# EAGLE design pierwszy_schemat_dobrow (EAGLE 9.6.2)
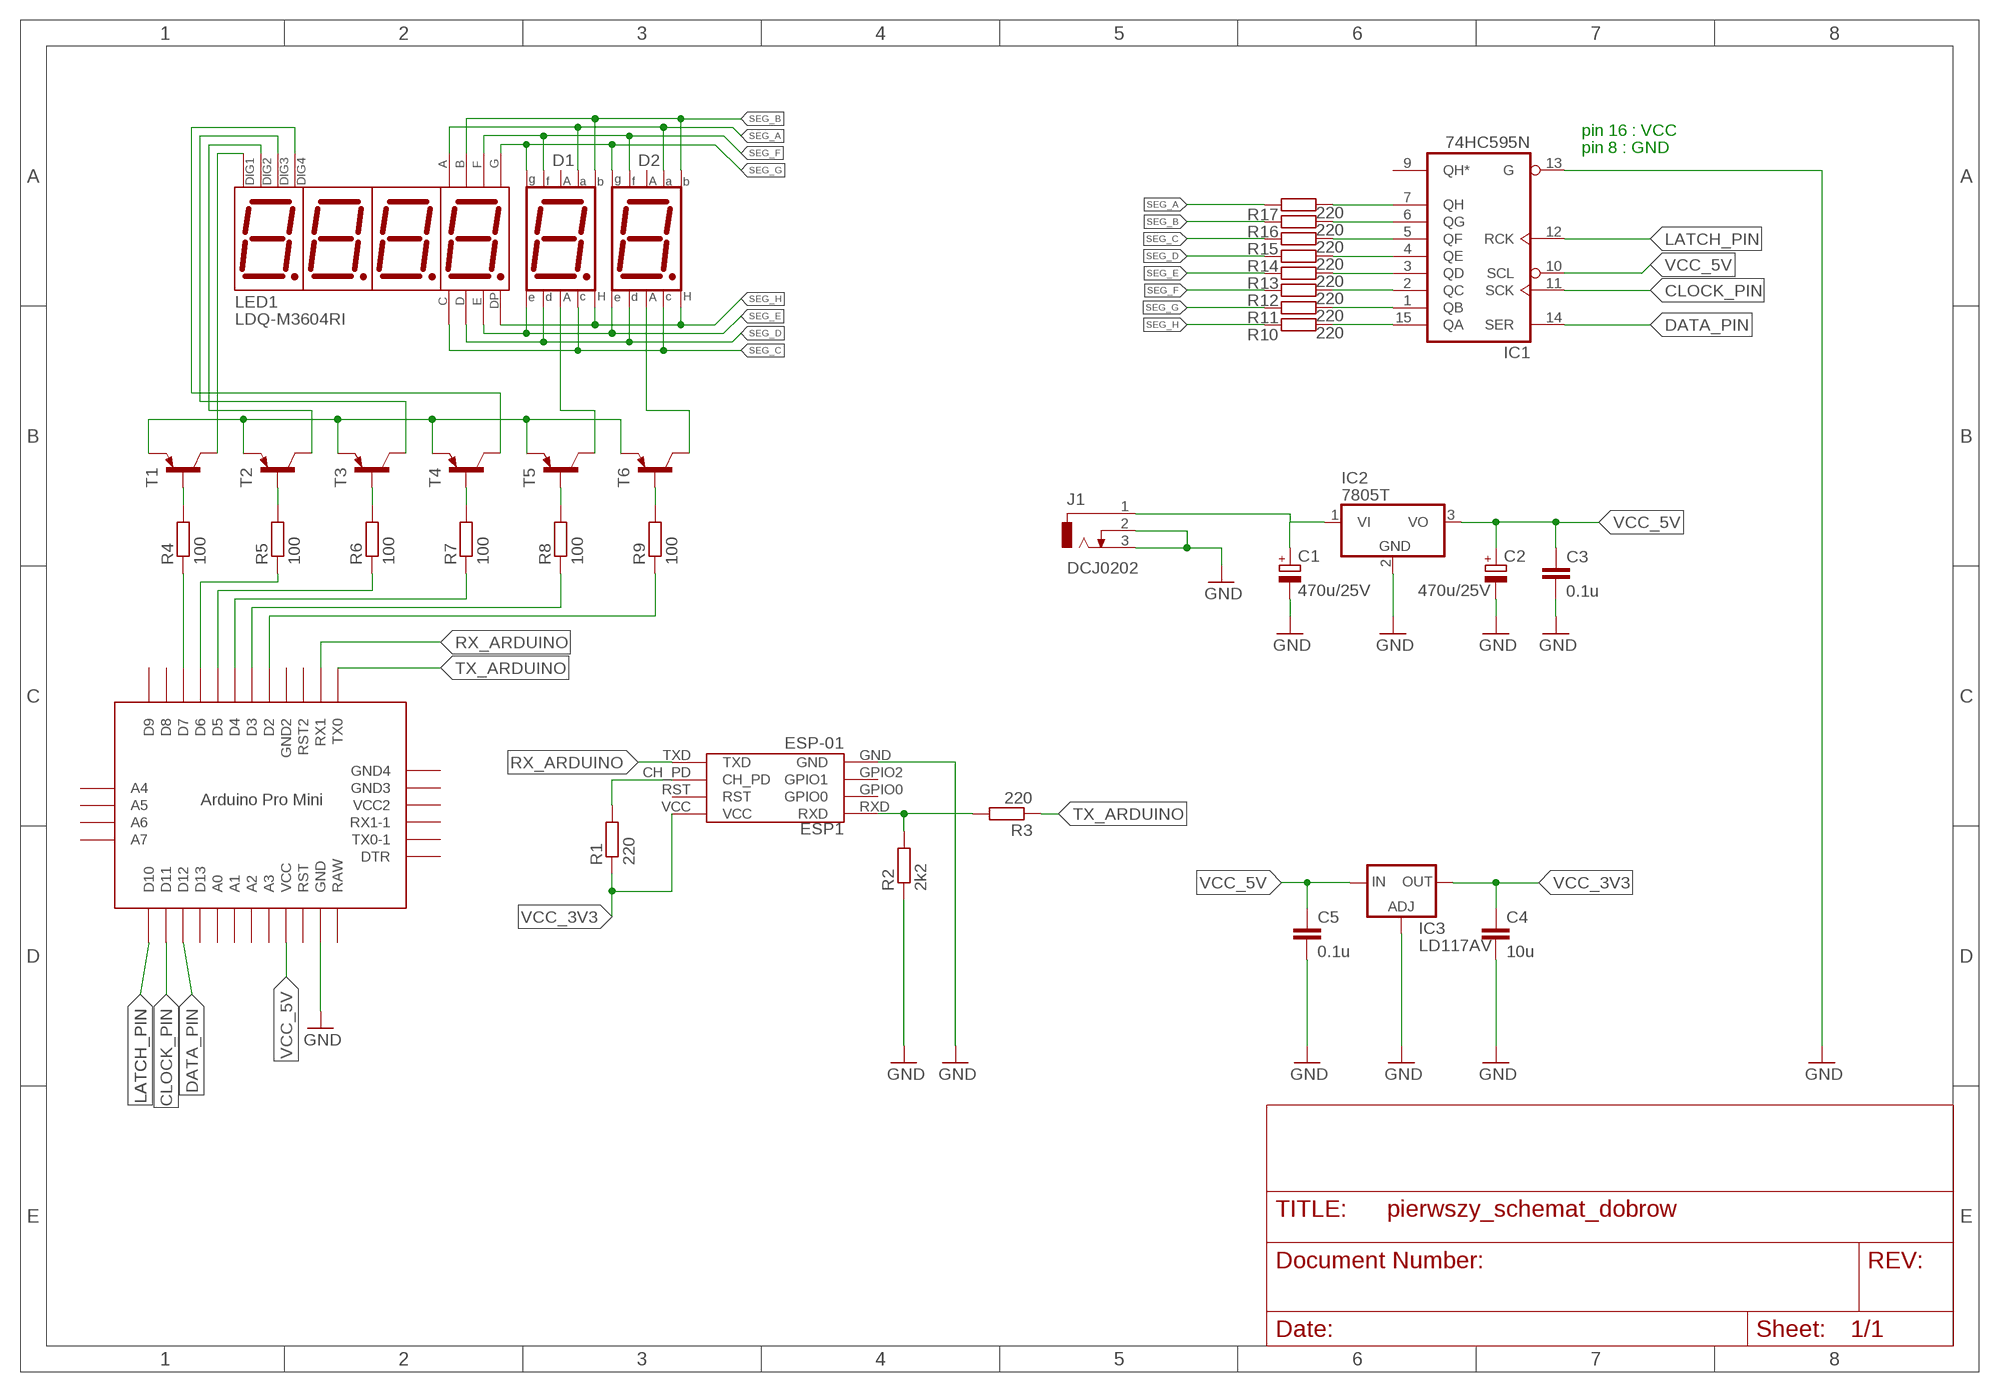
[diagram p0: schematic, sheet 1]

## Parts
C1  470u/25V  CPOL-EUE5-8.5  [E5-8,5]
C2  470u/25V  CPOL-EUE5-8.5  [E5-8,5]
C3  0.1u  C-EU025-025X050  [C025-025X050]
C4  10u  C-EU025-025X050  [C025-025X050]
C5  0.1u  C-EU025-025X050  [C025-025X050]
D1  7SEG-CA  [7SEG-13]
D2  7SEG-CA  [7SEG-13]
ESP1  ESP-01  [ESP-01]
IC1  74HC595N  [DIL16]
IC2  7805T  [TO220H]
IC3  LD117AV  [TO220L1]
J1  DCJ0202  [DCJ0202]
LED1  LDQ-M3604RI  [LDQ-M3604RI]
R1  220  R-EU_0414/15  [0414/15]
R2  2k2  R-EU_0414/15  [0414/15]
R3  220  R-EU_0414/15  [0414/15]
R4  100  R-EU_0414/15  [0414/15]
R5  100  R-EU_0414/15  [0414/15]
R6  100  R-EU_0414/15  [0414/15]
R7  100  R-EU_0414/15  [0414/15]
R8  100  R-EU_0414/15  [0414/15]
R9  100  R-EU_0414/15  [0414/15]
R10  220  R-EU_0414/15  [0414/15]
R11  220  R-EU_0414/15  [0414/15]
R12  220  R-EU_0414/15  [0414/15]
R13  220  R-EU_0414/15  [0414/15]
R14  220  R-EU_0414/15  [0414/15]
R15  220  R-EU_0414/15  [0414/15]
R16  220  R-EU_0414/15  [0414/15]
R17  220  R-EU_0414/15  [0414/15]
T1  BC556A-PNP-TO92-EBC  [TO92-EBC]
T2  BC556A-PNP-TO92-EBC  [TO92-EBC]
T3  BC556A-PNP-TO92-EBC  [TO92-EBC]
T4  BC556A-PNP-TO92-EBC  [TO92-EBC]
T5  BC556A-PNP-TO92-EBC  [TO92-EBC]
T6  BC556A-PNP-TO92-EBC  [TO92-EBC]
U$1  PRO-MINI  [PRO-MINI]

## Nets
CLOCK_PIN: IC1.11(SCK) U$1.D11
DATA_PIN: IC1.14(SER) U$1.D12
GND: C1.- C2.- C3.2 C4.2 C5.2 ESP1.GND IC1.13(G) IC2.2(GND) IC3.1(ADJ) J1.2 J1.3 R2.1 U$1.GND
LATCH_PIN: IC1.12(RCK) U$1.D10
N$1: R4.2 T1.B
N$2: R5.2 T2.B
N$3: R6.2 T3.B
N$4: R7.2 T4.B
N$5: R8.2 T5.B
N$6: R9.2 T6.B
N$7: T1.E T2.E T3.E T4.E T5.E T6.E
N$8: LED1.9(DIG2) T2.C
N$10: ESP1.CH_PD R1.2
N$12: IC1.15(QA) R10.2
N$13: IC1.1(QB) R11.2
N$14: IC1.2(QC) R12.2
N$15: IC1.3(QD) R13.2
N$16: IC1.4(QE) R14.2
N$17: IC1.5(QF) R15.2
N$18: IC1.6(QG) R16.2
N$19: IC1.7(QH) R17.2
N$26: LED1.12(DIG1) T1.C
N$27: LED1.8(DIG3) T3.C
N$28: LED1.6(DIG4) T4.C
N$29: D1.8(CA2) T5.C
N$30: D2.8(CA2) T6.C
N$31: R4.1 U$1.D7
N$32: R5.1 U$1.D6
N$33: R6.1 U$1.D5
N$34: R7.1 U$1.D4
N$35: R8.1 U$1.D3
N$36: R9.1 U$1.D2
RX_ARDUINO: ESP1.TXD U$1.RX1
SEG_A: D1.7(A) D2.7(A) LED1.11(A) R17.1
SEG_B: D1.6(B) D2.6(B) LED1.7(B) R16.1
SEG_C: D1.4(C) D2.4(C) LED1.4(C) R15.1
SEG_D: D1.2(D) D2.2(D) LED1.2(D) R14.1
SEG_E: D1.1(E) D2.1(E) LED1.1(E) R13.1
SEG_F: D1.9(F) D2.9(F) LED1.10(F) R12.1
SEG_G: D1.10(G) D2.10(G) LED1.5(G) R11.1
SEG_H: D1.5(DP) D2.5(DP) LED1.3(DP) R10.1
TX_ARDUINO: ESP1.RXD R2.2 R3.1 R3.2 U$1.TX0
VCC_3V3: C4.1 ESP1.VCC IC3.2(OUT) R1.1
VCC_5V: C2.+ C3.1 C5.1 IC1.10(SCL) IC2.3(VO) IC3.3(IN) U$1.VCC
VIN_9V: C1.+ IC2.1(VI) J1.1
Unconnected: D1.3(CA1) D2.3(CA1) ESP1.GPIO0 ESP1.GPIO2(GPIO1) ESP1.RST IC1.9(QH*) U$1.A0 U$1.A1 U$1.A2 U$1.A3 U$1.A4 U$1.A5 U$1.A6 U$1.A7 U$1.D8 U$1.D9 U$1.D13 U$1.DTR U$1.GND1(GND2) U$1.GND2(GND4) U$1.GND3 U$1.RST U$1.RST1(RST2) U$1.RX1-1 U$1.TX0-1 U$1.VCC1(VCC2)

## Notes on the sheet
- pin 16 : VCC
- pin 8 : GND

## Power pins joined to a net without a drawn wire
GND: IC1.8(GND)
RAW: U$1.RAW
VCC: IC1.16(VCC)

## Library data of the parts
C1 C2 = rcl:CPOL-EU: POLARIZED CAPACITOR, European symbol; SPICEPREFIX: C
C3-C5 = rcl:C-EU: CAPACITOR, European symbol; SPICEPREFIX: C
D1 D2 = 7SEG-vertical:7SEG-CA: 7-segment DISPLAY single anode, 13 mm
ESP1 = ESP-01:ESP-01: Check prices <https://pricing.snapeda.com/parts/ESP-01/AI-Thinker/view-part?ref=eda>; AVAILABILITY: Not in stock; DESCRIPTION: ESP-01M ESP8266 DIP Adapter series Transceiver; 802.11 b/g/n (Wi-Fi, WiFi, WLAN) Evaluation Board; MF: AI-Thinker; MP: ESP-01; PACKAGE: Non-Standard AI-Thinker; PRICE: None
IC1 = 74xx-eu:74*595: 8-bit SHIFT REGISTER, output latch
IC2 = adafruit:78*: Positive VOLTAGE REGULATOR Added bigger pads to the TO-92 package
IC3 = v-reg:LD117A?*: Low drop fixed and adjustable positive voltage regulators 1 A Source: http://www.st.com/stonline/products/literature/ds/7194/ld1117axx.pdf
J1 = con-jack:DCJ0202: DC POWER JACK Source: DCJ0202.pdf; OC_FARNELL: unknown; OC_NEWARK: unknown
LED1 = LDQ-M3604RI:LDQ-M3604RI: Check prices <https://pricing.snapeda.com/parts/LDQ-M3604RI/Lumex/view-part?ref=eda>; AVAILABILITY: In Stock; DESCRIPTION: Display, Seven Segment, 9.2MM, Red; MF: Lumex; MP: LDQ-M3604RI; PACKAGE: None; PRICE: None
R1-R17 = rcl:R-EU_: RESISTOR, European symbol; SPICEPREFIX: R
T1-T6 = transistor:*-PNP-: PNP Transistror
U$1 = Arduino-clone:PRO-MINI: Arduion Pro Mini Clone V1.0 www.betemcu.cu

## Board
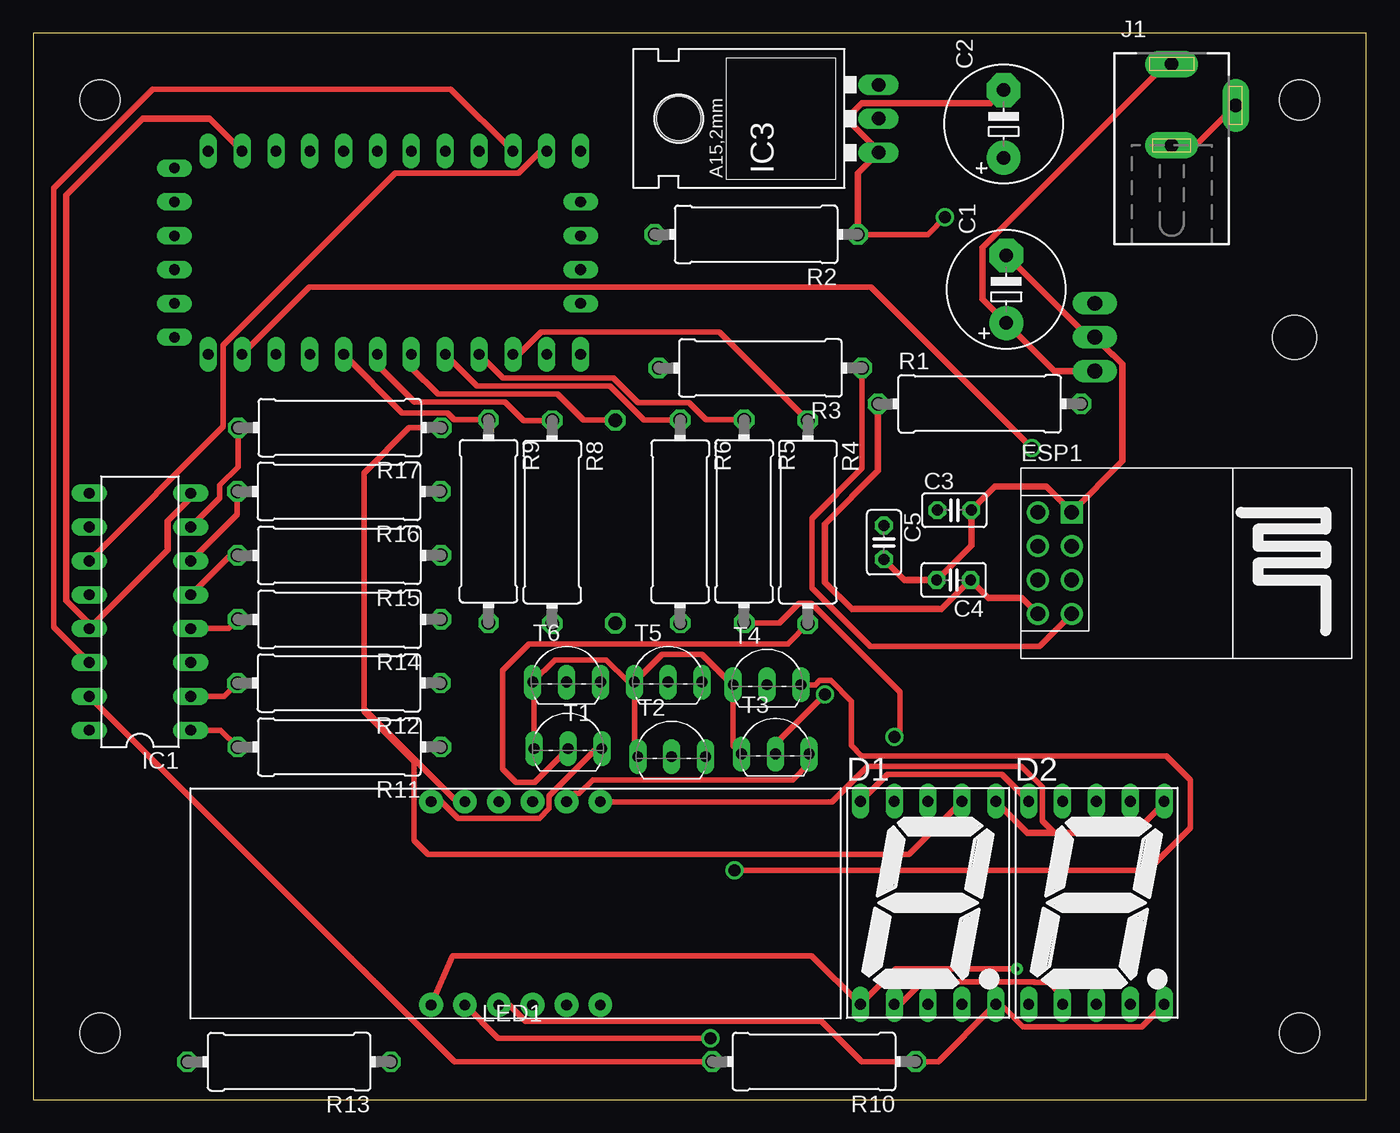
[diagram p1: board, top side]
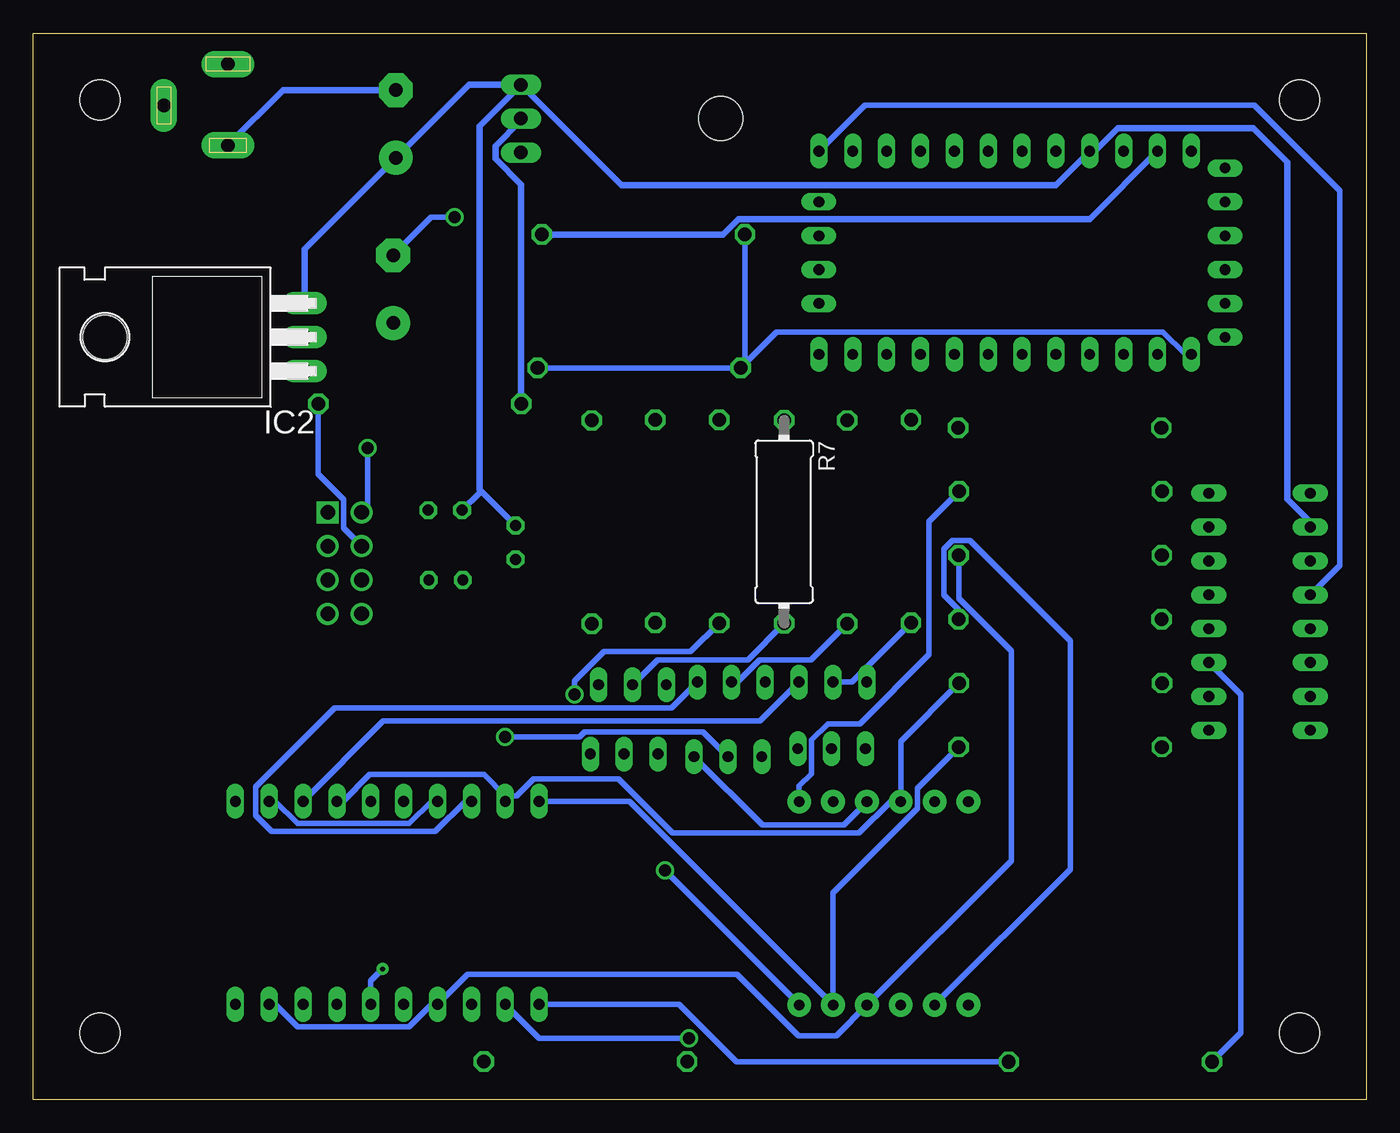
[diagram p2: board, bottom side, seen from below]

Size 100 x 80 mm. Coordinates in mm from the lower left corner, seen from the top.
Outline: 0,0 100,0 100,80 0,80 0,0
Copper layers (1*16): Top 0.035mm / dielectric 1.5mm / Bottom 0.035mm
Design rules "default *": minimum track width 6mil, minimum drill 0.35mm, track to track 8mil, track to pad 6mil, pad to pad 6mil, via to via 6mil, smd to smd 6mil, copper to edge 20mil, drill to drill 6mil, minimum pad ring 10mil, minimum via ring 8mil, stop-mask expansion 4mil, vias tented up to drill 0mil, thermal gap 10mil
Holes 3 mm at 5,5 95,5 95,75 5,75

### Footprints (pad centres in the part's own frame; a part is rotated, then mirrored left to right if it is on the bottom)
E5-8,5 = drill 1.016 pad 2.54: + -2.54,0 | drill 1.016 pad 2.54 octagon: - 2.54,0
C025-025X050 = drill 0.813 octagon: 1 -1.27,0; 2 1.27,0
7SEG-13 = drill 0.813 long: 1 -5.08,-7.62; 2 -2.54,-7.62; 3 0,-7.62; 4 2.54,-7.62; 5 5.08,-7.62; 6 5.08,7.62; 7 2.54,7.62; 8 0,7.62; 9 -2.54,7.62; 10 -5.08,7.62
ESP-01 = drill 1.1: CH_PD 1.27,1.27; GPIO0 3.81,-1.27; GPIO2 3.81,1.27; RST 1.27,-1.27; RXD 3.81,-3.81; TXD 1.27,3.81; VCC 1.27,-3.81 | drill 1.1 square: GND 3.81,3.81
DIL16 = drill 0.813 long: 1 -8.89,-3.81; 2 -6.35,-3.81; 3 -3.81,-3.81; 4 -1.27,-3.81; 5 1.27,-3.81; 6 3.81,-3.81; 7 6.35,-3.81; 8 8.89,-3.81; 9 8.89,3.81; 10 6.35,3.81; 11 3.81,3.81; 12 1.27,3.81; 13 -1.27,3.81; 14 -3.81,3.81; 15 -6.35,3.81; 16 -8.89,3.81
TO220H = drill 1.118 long: 1 -2.54,-10.16; 2 0,-10.16; 3 2.54,-10.16 | hole 3.302: 0,4.826
TO220L1 = drill 1.016 long: 1 -2.54,-3.81; 2 0,-3.81; 3 2.54,-3.81 | hole 3.302: 0,11.176
DCJ0202 = drill 1 pad 2 long: 1 0,3.1; 2 4.8,0; 3 0,-3
LDQ-M3604RI = drill 0.8 pad 1.778: 1 -6.35,-7.62; 2 -3.81,-7.62; 3 -1.27,-7.62; 4 1.27,-7.62; 5 3.81,-7.62; 6 6.35,-7.62; 7 6.35,7.62; 8 3.81,7.62; 9 1.27,7.62; 10 -1.27,7.62; 11 -3.81,7.62; 12 -6.35,7.62
0414/15 = drill 1.016 octagon: 1 -7.62,0; 2 7.62,0
TO92-EBC = drill 0.813 long: B 0,-1.27; C 2.54,-1.27; E -2.54,-1.27
PRO-MINI = drill 0.8 long: A0 8.89,8.89; A1 8.89,11.43; A2 8.89,13.97; A3 8.89,16.51; A4 -2.54,-1.27; A5 0,-1.27; A6 2.54,-1.27; A7 5.08,-1.27; D2 -6.35,16.51; D3 -6.35,13.97; D4 -6.35,11.43; D5 -6.35,8.89; D6 -6.35,6.35; D7 -6.35,3.81; D8 -6.35,1.27; D9 -6.35,-1.27; D10 8.89,-1.27; D11 8.89,1.27; D12 8.89,3.81; D13 8.89,6.35; DTR 7.62,29.21; GND 8.89,24.13; GND1 -6.35,19.05; GND2 -5.08,29.21; GND3 -2.54,29.21; RAW 8.89,26.67; RST 8.89,21.59; RST1 -6.35,21.59; RX1 -6.35,24.13; RX1-1 2.54,29.21; TX0 -6.35,26.67; TX0-1 5.08,29.21; VCC 8.89,19.05; VCC1 0,29.21

### Placement (x,y rotation side)
C1  73,60.8 90 top
C2  72.8,73.2 90 top
C3  69.1,44.22 0 top
C4  69.05,38.98 180 top
C5  63.82,41.8 270 top
D1  67.13,14.76 0 top
D2  79.76,14.76 0 top
ESP1  74.1,40.25 0 top
IC1  8,36.6 90 top
IC2  89.8,57.2 90 bottom
IC3  59.6,73.6 90 top
J1  85.4,74.6 0 top
LED1  36.19,14.72 0 top
R1  71,52.2 0 top
R2  54.23,64.91 180 top
R3  54.55,54.89 180 top
R4  58.11,43.33 270 top
R5  53.33,43.39 270 top
R6  48.53,43.37 270 top
R7  43.67,43.35 270 bottom
R8  38.93,43.33 270 top
R9  34.15,43.39 270 top
R10  58.57,2.85 180 top
R11  22.95,26.45 180 top
R12  22.93,31.25 180 top
R13  19.19,2.83 180 top
R14  22.97,36.03 180 top
R15  22.95,40.83 180 top
R16  22.93,45.63 180 top
R17  22.99,50.41 180 top
T1  40.11,27.59 0 top
T2  47.89,26.99 0 top
T3  55.67,27.19 0 top
T4  55.05,32.39 0 top
T5  47.63,32.59 0 top
T6  40.01,32.59 0 top
U$1  39.79,62.27 90 top

### Tracks (layer width: path | path; a pad name or v marks a point on that pad's centre or on a via)
CLOCK_PIN
  Top 0.4: IC1.11 14.26,50.48 14.26,56.59 27.16,69.5 36.4,69.5 38.06,71.16 U$1.D11
DATA_PIN
  Top 0.4: U$1.D12 31.32,75.82 8.95,75.82 1.52,68.39 1.52,35.46 IC1.14
GND  (via drill 0.9)
  Top 0.4: R2.1 67.11,64.91 v68.4,66.2
  Top 0.5: 72.4,75.34 C2.- 71.82,74.76 62.17,74.76 61.48,74.08 61.48,73.12 63.41,71.19 IC3.1 61.85,69.5 R2.1 | 77.91,44.09 76,46 72.15,46 C3.2 70.37,41.57 C4.2 65.37,38.98 C5.2 | 77.91,44.09 ESP1.GND | 11.37,45.49 IC1.8 11.81,45.11 10.09,43.39 10.09,41.23 IC1.13 4.19,35.71 2.47,37.43 2.47,67.87 8.2,73.6 13.22,73.6 U$1.GND | J1.3 87.2,71.6 J1.2 | C1.- 79.14,57.2 IC2.2 80.94,55.9 80.99,55.9 81.72,55.17 81.72,47.9 77.91,44.09
  Bottom 0.4: v68.4,66.2 70.14,66.2 C1.-
  Bottom 0.5: R2.1 48.26,64.91 47.09,66.07 20.75,66.07 U$1.GND | C2.- 81.26,75.74 J1.3
LATCH_PIN
  Bottom 0.4: U$1.D10 37.62,74.6 8.4,74.6 2,68.2 2,40.06 IC1.12
N$1
  Top 0.4: R4.2 56.6,34.2 37.2,34.2 35.2,32.2 35.2,24.8 36.2,23.8 37.59,23.8 T1.B
N$2  (via drill 0.9)
  Top 0.4: R5.2 55.99,35.77 57.45,37.22 58.37,37.22 65,30.6 65,27.6 v64.6,27.2
  Bottom 0.4: v64.6,27.2 59.02,27.2 58.63,27.59 49.76,27.59 T2.B
N$3  (via drill 0.9)
  Top 0.4: v59.4,30.4 55.67,26.67 T3.B
  Bottom 0.4: R6.2 50.68,33.6 57.2,33.6 59.4,31.4 v59.4,30.4
N$4
  Bottom 0.4: R7.2 46.4,33 53.17,33 T4.B
N$5
  Bottom 0.4: R8.2 41.65,32.99 45.51,32.99 47.18,31.32 T5.B
N$6
  Bottom 0.4: R9.2 38.6,31.32 T6.B
N$7
  Top 0.4: T3.E 52.51,26.54 T4.E 52.46,31.12 50.18,33.4 47.17,33.4 T5.E | T2.E 45.09,25.98 T5.E | T1.E 37.57,31.22 T6.E 39.14,32.99 42.97,32.99 44.64,31.32 T5.E
N$8
  Bottom 0.4: LED1.9 39.2,20.6 45.31,20.6 T2.C
N$10
  Bottom 0.4: R1.2 78.62,46.92 76.73,45.03 76.73,42.88 ESP1.CH_PD
N$12
  Top 0.4: R10.2 31.59,2.85 IC1.15
N$13
  Top 0.4: IC1.1 14.07,27.71 R11.2
N$14
  Top 0.4: IC1.2 14.31,30.25 R12.2
N$15
  Bottom 0.4: IC1.3 9.41,30.39 9.41,4.99 R13.2
N$16
  Top 0.4: IC1.4 14.65,35.33 R14.2
N$17
  Top 0.4: IC1.5 14.77,40.83 R15.2
N$18
  Top 0.4: IC1.6 15.31,43.91 R16.2
N$19
  Top 0.4: IC1.7 14,45.14 14,46.09 15.37,47.47 R17.2
N$26
  Top 0.4: T1.C 42.22,26.32 38.7,22.8 38.7,21.83 37.97,21.1 31.87,21.1 30.62,22.34 LED1.12
N$27
  Top 0.4: LED1.8 40.64,22.98 40.96,22.98 41.98,24 57,24 58.21,25.21 T3.C
N$28  (via drill 0.9)
  Top 0.4: T4.C 58.67,31.12 58.97,31.43 59.83,31.43 61.37,29.88 61.37,26.57 62.15,25.8 85,25.8 86.8,24 86.8,20.4 83.6,17.2 v52.6,17.2
  Bottom 0.4: v52.6,17.2 42.54,7.14 LED1.6
N$29
  Bottom 0.4: T5.C 52.12,29.37 77.4,29.37 83.31,23.46 83.31,21.3 82.12,20.1 69.85,20.1 67.58,22.38 D1.8
N$30
  Bottom 0.4: T6.C 45.47,28.4 73.74,28.4 D2.8
N$31
  Top 0.4: U$1.D7 36.44,55.92 38.1,57.58 51.48,57.58 R4.1
N$32
  Top 0.4: U$1.D6 35.23,54.13 43.53,54.13 45.37,52.3 49.19,52.3 50.49,51.01 R5.1
N$33
  Top 0.4: U$1.D5 33.29,53.53 43.28,53.53 45.83,50.99 R6.1
N$34
  Top 0.4: U$1.D4 28.36,54.92 30.35,52.93 39.33,52.93 41.29,50.97 R7.1
N$35
  Top 0.4: R8.1 36.79,50.95 35.41,52.32 28.62,52.32 25.82,55.12 U$1.D3
N$36
  Top 0.4: R9.1 31.59,51.01 31.07,51.52 27.68,51.52 U$1.D2
RX_ARDUINO  (via drill 0.9)
  Top 0.4: U$1.RX1 20.68,60.94 62.86,60.94 v74.9,48.9
  Bottom 0.4: v74.9,48.9 74.9,44.53 ESP1.TXD
SEG_A
  Top 0.4: R17.1 28.21,50.41 24.8,47 24.8,29.32 | 24.8,29.32 24.8,29.12 28.56,25.36 28.56,19.44 29.6,18.4 65.69,18.4 D1.7 | LED1.11 31.78,22.34 24.8,29.32
  Bottom 0.4: D2.7 81.85,22.38 80.18,20.71 71.79,20.71 70.12,22.38 D1.7
SEG_B
  Top 0.4: LED1.7 59.92,22.34 62.58,25 74.15,25 75.69,23.46 75.69,20.91 76.6,20
  Top 0.5: D2.6 84.84,22.24 82.6,20 76.6,20 74.59,20 D1.6
  Bottom 0.4: R16.1 32.8,43.38 32.8,33.4 38,28.2 40.4,28.2 41.64,26.96 41.64,24.44 42.54,23.54 LED1.7
SEG_C
  Bottom 0.4: D2.4 81.85,7.14 80.18,5.47 71.79,5.47 70.12,7.14 D1.4 67.41,9.4 47.2,9.4 42.6,4.8 39.76,4.8 LED1.4 26.64,17.92 26.64,33.65 30.57,37.59 R15.1
SEG_D  (via drill 0.9)
  Top 0.4: D1.2 65.04,7.14 66.71,8.81 75.1,8.81 75.11,8.8 76.2,8.8 77.22,7.78 D2.2 | LED1.2 34.88,4.6 v50.8,4.6
  Bottom 0.4: v50.8,4.6 62.05,4.6 D1.2 | R14.1 30.59,36.75 31.68,37.85 31.68,41.29 31.03,41.94 29.74,41.94 22.2,34.4 22.2,17.28 LED1.2
SEG_E  (via drill 0.35 pad 0.9)
  Top 0.4: LED1.1 31.45,10.8 58.39,10.8 D1.1 64.71,9.8 v73.8,9.8
  Bottom 0.4: v73.8,9.8 74.68,8.92 D2.1 | R13.1 47.23,2.83 51.54,7.14 D1.1
SEG_F
  Bottom 0.4: D2.9 76.77,22.38 74.75,24.4 66.2,24.4 64.59,22.79 | 64.59,22.79 D1.9 | R12.1 34.92,26.88 LED1.10 35.7,22.34 38.05,20 45.56,20 52.05,20 56.1,24.05 62.47,24.05 63.73,22.79 64.59,22.79
SEG_G
  Top 0.4: D2.10 72.66,24.4 64.07,24.4 D1.10
  Bottom 0.4: D1.10 55.28,22.38 LED1.5 40,15.5 33.68,21.83 33.68,23.34 R11.1
SEG_H
  Top 0.4: 71.94,6.87 67.92,2.85 R10.1 62.15,2.85 59.14,5.86 36.95,5.86 35.7,7.1 LED1.3 | 71.94,6.87 D1.5 | 71.94,6.87 72.86,6.87 74.26,5.47 83.17,5.47 D2.5
TX_ARDUINO
  Top 0.4: 62.57,54.89 R3.1 62.17,47.37 58.4,43.6 58.4,38.4 62.8,34 75.47,34 ESP1.RXD
  Bottom 0.4: R2.2 46.61,55.21 R3.2 | U$1.TX0 13.58,55.92 15.24,57.58 44.24,57.58 R3.2 | R3.2 R3.1
VCC_3V3
  Top 0.5: R1.1 63.38,47.18 59.4,43.2 59.4,38.8 61.4,36.8 68.14,36.8 C4.1 71.66,37.64 74.17,37.64 ESP1.VCC
  Bottom 0.5: R1.1 63.41,52.23 63.41,68.65 65.34,70.58 65.34,71.54 63.41,73.47 IC3.2
VCC_5V
  Bottom 0.5: IC3.3 66.54,73.01 66.54,45.79 C5.1 | IC3.3 67.32,76.14 C2.+ 79.64,63.82 IC2.3 | IC3.3 55.87,68.6 23.3,68.6 U$1.VCC 20.35,71.16 18.64,72.87 8.47,72.87 5.91,70.31 5.91,45.05 4.19,43.33 IC1.10 4.84,42.95 | 66.54,45.51 C3.1
VIN_9V
  Top 0.5: IC2.1 76.6,54.66 C1.+ 71.2,60.06 71.2,63.91 72.71,65.41 85,77.7 J1.1